# Altium schematic sheet Shematic for Diplom.SchDoc
size 420 x 297 mm; Razrabotal: Гришко; Proveril: {Проверил}; Tkontr: {Т.контр}; Nkontr: {Н. контр.}; Utverdil: {Утвердил}; Oboznachenie: {Обозначение}; Naimenovanie: {Наименование}
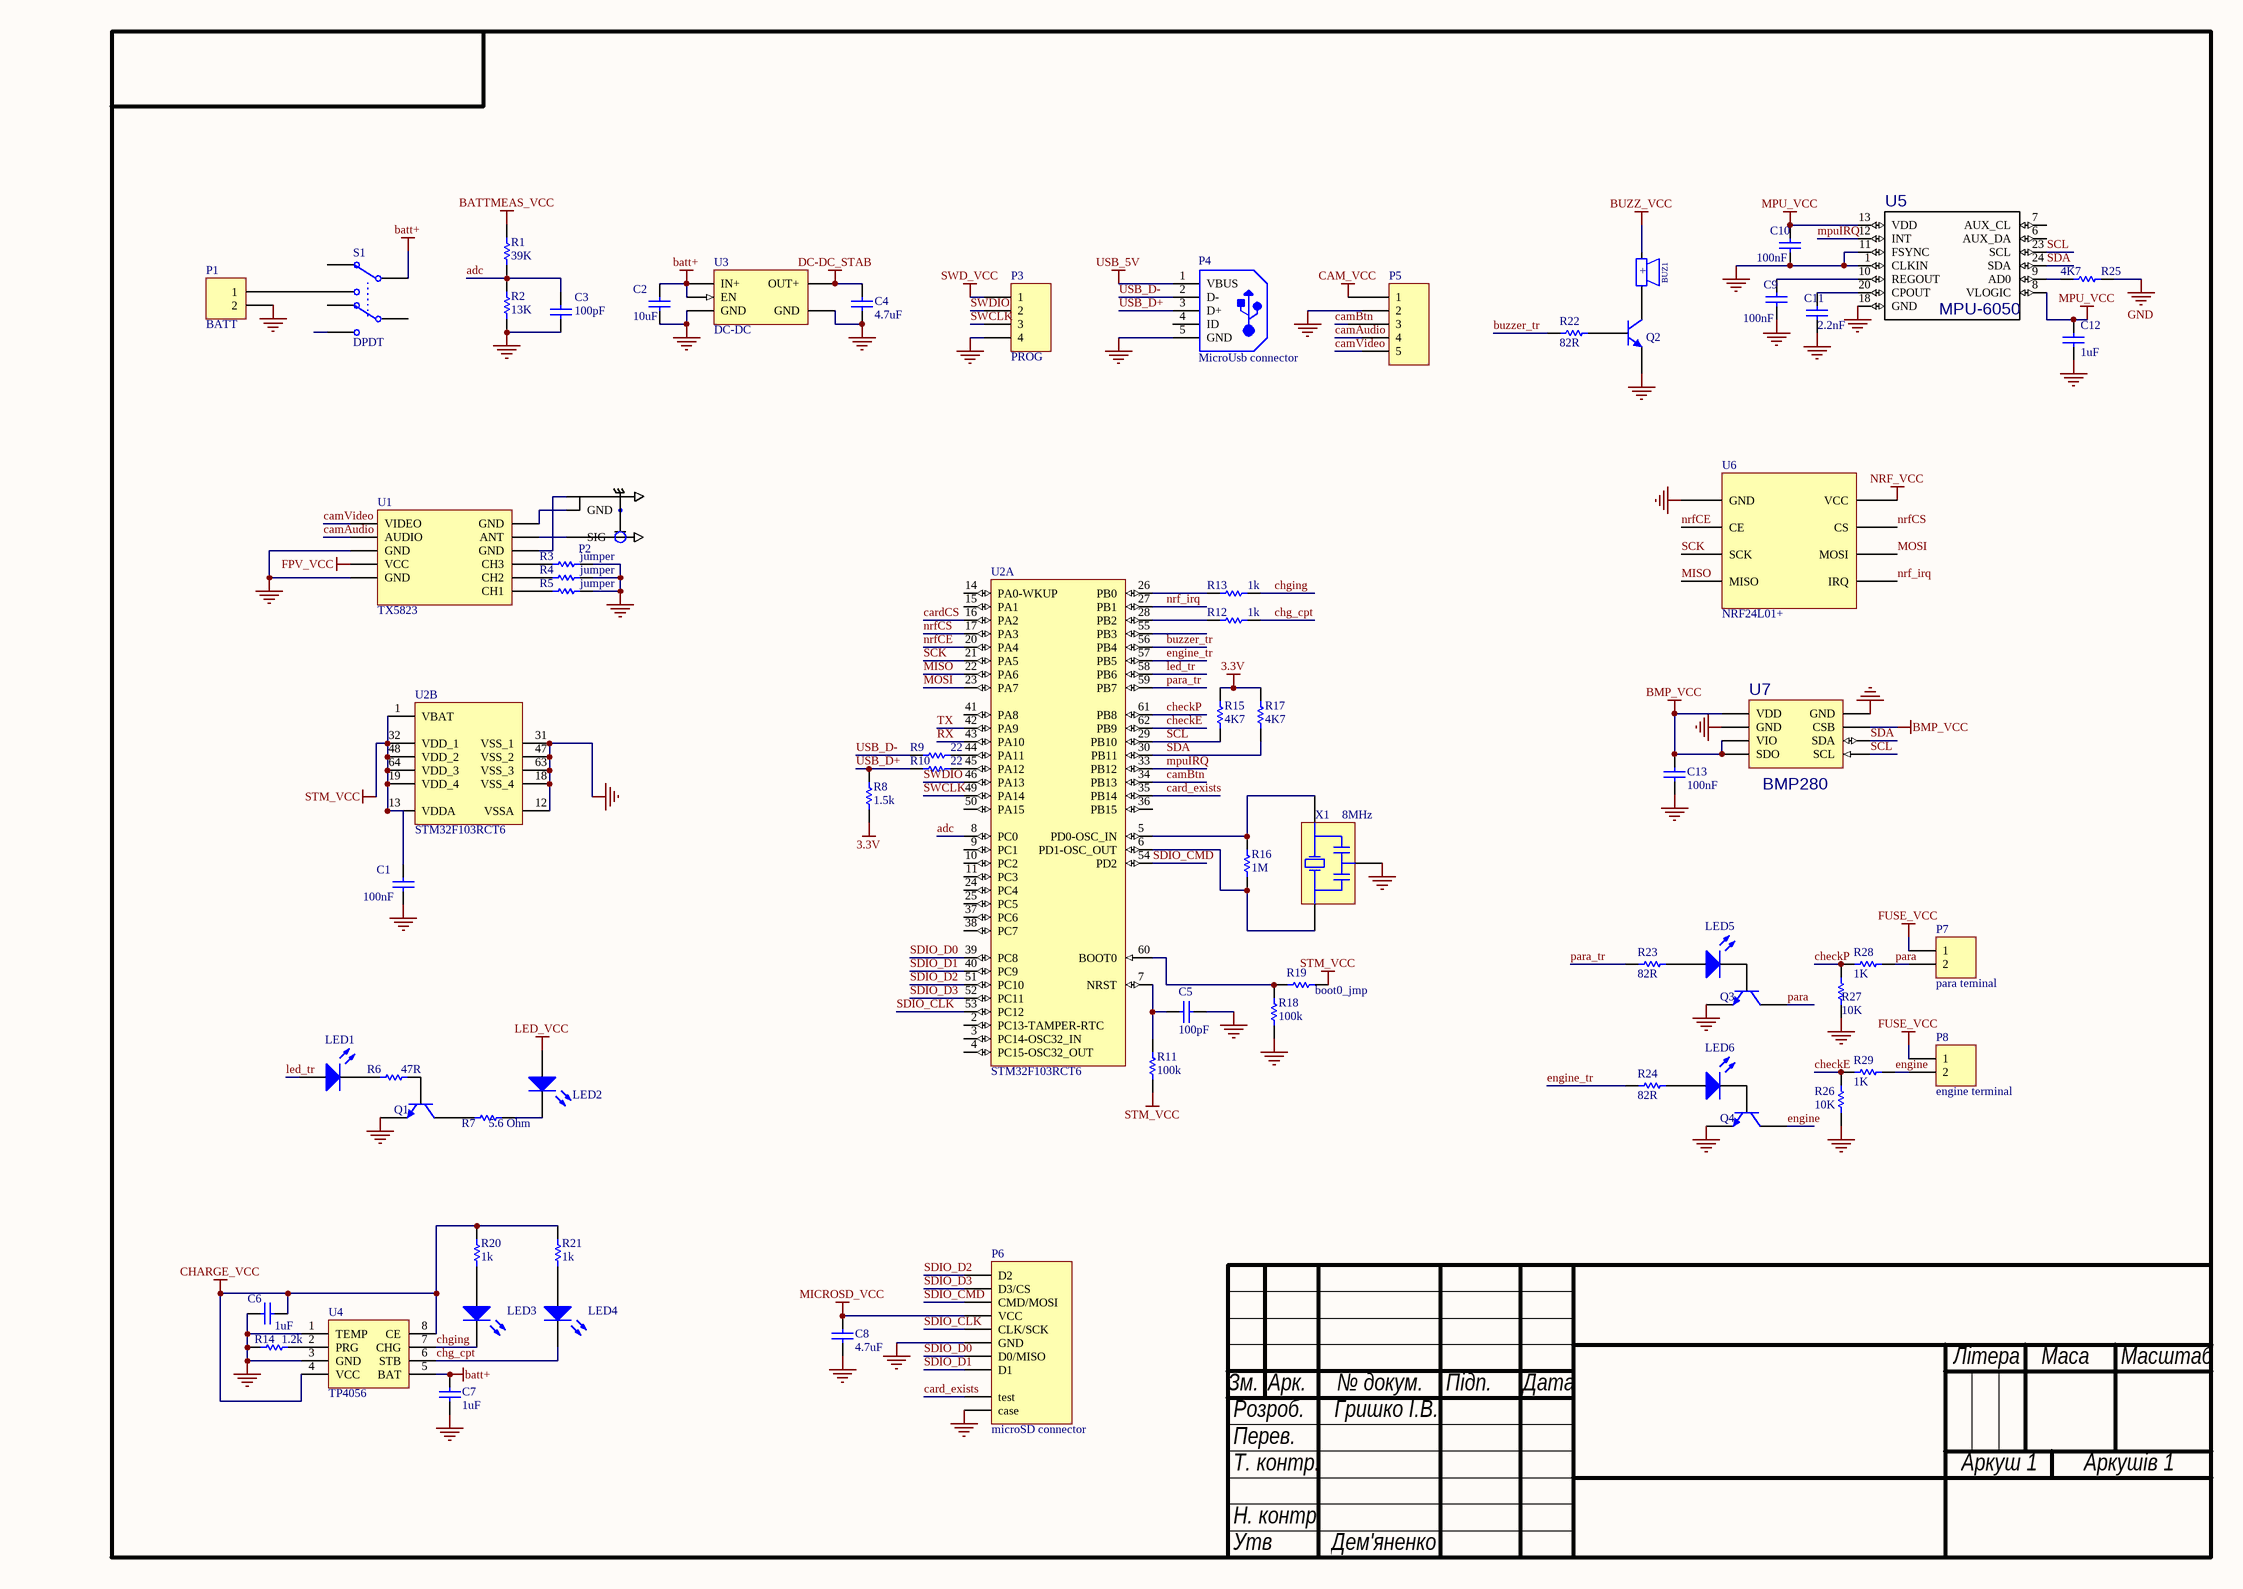
[diagram p0: Shematic for Diplom.SchDoc]

## Parts
(Parts that share a designator on the sheet are numbered #1, #2 ... from top to bottom, then left to right.)
BUZ1  Buzzer  [BUZ12X7,6MM]  (value not drawn)
C1  100nF  [CAPC0603(1608)100_N]
C2  10uF  [CAPC0805(2012)100_L]
C3  100pF  [CAPC0805(2012)100_L]
C4  4.7uF  [CAPC0603(1608)100_N]
C5  100pF  [CAPC0805(2012)100_L]
C6  1uF  [CAP 0805 (2012) L]
C7  1uF  [CAP 0805 (2012) L]
C8  4.7uF  [CAPC0603(1608)100_N]
C9  100nF  [CAPC0603(1608)100_N]
C10  100nF  [CAPC0603(1608)100_N]
C11  2.2nF  [CAPC0603(1608)100_L]
C12  1uF  [CAPC0603(1608)100_L]
C13  100nF  [CAPC0603(1608)100_N]
LED1  0805 LED  [0805 LED]  (value not drawn)
LED2  3W LED  [3W LED red]  (value not drawn)
LED3  0805 LED  [0805 LED]  (value not drawn)
LED4  0805 LED  [0805 LED]  (value not drawn)
LED5  0805 LED  [0805 LED]  (value not drawn)
LED6  0805 LED  [0805 LED]  (value not drawn)
P1  BATT  [XH-2]
P2  IPX  [IPX]  (value not drawn)
P3  PROG  [PLS-4]
P4  MicroUsb connector  [MicroUsb connector]
P5  XH2.54-5  [XH2.54-5]  (value not drawn)
P6  microSD connector  [Micro SD holder + card]
P7  para teminal  [screw-con-2]
P8  engine terminal  [screw-con-2]
Q1  MMBT2222A  [INF-SOT23_M]  (value not drawn)
Q2  MMBT2222A  [INF-SOT23_M]  (value not drawn)
Q3  MMBT2222A  [INF-SOT23_L]  (value not drawn)
Q4  MMBT2222A  [INF-SOT23_N]  (value not drawn)
R1  39K  [6-0805_L]
R2  13K  [RESC0805(2012)_L]
R3  jumper  [RES 0603 (1608) L]
R4  jumper  [RES 0603 (1608) L]
R5  jumper  [RES 0603 (1608) L]
R6  47R  [RESC0805(2012)_N]
R7  5.6 Ohm  [RESC0805(2012)_M]
R8  1.5k  [RESC0603(1608)_N]
R9  22  [RESC0603(1608)_N]
R10  22  [RESC0603(1608)_N]
R11  100k  [RES 0603 (1608) L]
R12  1k  [RESC0805(2012)_N]
R13  1k  [RESC0805(2012)_N]
R14  1.2k  [RES 0805 (2012) L]
R15  4K7  [RESC0603(1608)_N]
R16  1M  [RES 0603 (1608) L]
R17  4K7  [RESC0603(1608)_N]
R18  100k  [RES 0603 (1608) L]
R19  boot0_jmp  [RES 0603 (1608) L]
R20  1k  [RESC0805(2012)_N]
R21  1k  [RESC0805(2012)_N]
R22  82R  [RESC0805(2012)_L]
R23  82R  [RESC0805(2012)_L]
R24  82R  [RESC0805(2012)_L]
R25  4K7  [RESC0603(1608)_N]
R26  10K  [RESC0805(2012)_L]
R27  10K  [RESC0805(2012)_L]
R28  1K  [RESC0805(2012)_L]
R29  1K  [RESC0805(2012)_L]
S1  DPDT  [DPDT  5.8mm SMD]
U1  TX5823  [TX5823]
U2#1  STM32F103RCT6  [STM-LQFP64_N]  (part A of 2)
U2#2  STM32F103RCT6  [STM-LQFP64_N]  (part B of 2)
U3  DC-DC  [DC-DC step up down S9]
U4  TP4056  [SOP-8 N pad]
U5  MPU-6050  [QFN-24-4MM2]
U6  NRF24L01+  [NRF24l01 ant]
U7  BMP280  [LGA-8 BMP280]
X1  8MHz  [MURA-CSTCE_G_A-3_V]

## Nets
3.3V: R8.2 R15.2 R17.2
batt+: C2.2 C7.2 S1.2 U3.4(IN+) U3.5(EN) U4.5(BAT)
BATTMEAS_VCC: R1.2
BMP_VCC: C13.2 U7.2(CSB) U7.5(SDO) U7.6(VIO) U7.8(VDD)
BUZZ_VCC: BUZ1.2
CAM_VCC: P5.1
CHARGE_VCC: C6.2 R20.2 R21.2 U4.4(VCC) U4.8(CE)
DC-DC_STAB: C4.2 U3.2(OUT+)
FPV_VCC: U1.4(VCC)
FUSE_VCC: P7.1 P8.1
GND: C1.1 C2.1 C3.1 C4.1 C5.1 C6.1 C7.1 C8.1 C9.1 C10.2 C11.1 C12.1 C13.1 P1.2 P3.4 P4.5(GND) P4.6(SHLD1) P4.7(SHLD2) P4.8(SHLD3) P4.9(SHLD4) P4.10(SHLD5) P4.11(SHLD6) P5.2 P6.0(case) P6.6(GND) Q1.2(E) Q2.2(E) Q3.2(E) Q4.2(E) R2.2 R3.2 R4.2 R5.2 R14.1 R18.1 R25.2 R26.1 R27.1 U1.3(GND) U1.5(GND) U2#2.12(VSSA) U2#2.18(VSS_4) U2#2.31(VSS_1) U2#2.47(VSS_2) U2#2.63(VSS_3) U3.1(GND) U3.3(GND) U4.1(TEMP) U4.3(GND) U4.PAD U5.1(CLKIN) U5.11(FSYNC) U5.18(GND) U6.1(GND) U7.1(GND) U7.7(GND) X1.2(GND)
LED_VCC: LED2.A
MICROSD_VCC: C8.2 P6.4(VCC)
MPU_VCC: C10.1 C12.2 U5.8(VLOGIC) U5.13(VDD)
NRF_VCC: U6.2(VCC)
STM_VCC: C1.2 R11.1 R19.1 U2#2.1(VBAT) U2#2.13(VDDA) U2#2.19(VDD_4) U2#2.32(VDD_1) U2#2.48(VDD_2) U2#2.64(VDD_3)
SWD_VCC: P3.1
USB_5V: P4.1(VBUS)
adc: C3.2 R1.1 R2.1 U2#1.8(PC0)
buzzer_tr: R22.1 U2#1.56(PB4)
camAudio: P5.4 U1.2(AUDIO)
camBtn: P5.3 U2#1.34(PB13)
camVideo: P5.5 U1.1(VIDEO)
card_exists: P6.9(test) U2#1.35(PB14)
cardCS: U2#1.16(PA2)
checkE: R26.2 R29.2 U2#1.62(PB9)
checkP: R27.2 R28.2 U2#1.61(PB8)
chg_cpt: LED4.2(K) R12.1 U4.6(STB)
chging: LED3.2(K) R13.1 U4.7(CHG)
engine: P8.2 Q4.3(C) R29.1
engine_tr: R24.1 U2#1.57(PB5)
led_tr: LED1.1(A) U2#1.58(PB6)
MISO: U2#1.22(PA6) U6.7(MISO)
MOSI: U2#1.23(PA7) U6.6(MOSI)
mpuIRQ: U2#1.33(PB12) U5.12(INT)
nrf_irq: U2#1.27(PB1) U6.8(IRQ)
nrfCE: U2#1.20(PA4) U6.3(CE)
nrfCS: U2#1.17(PA3) U6.4(CS)
para: P7.2 Q3.3(C) R28.1
para_tr: R23.1 U2#1.59(PB7)
RX: U2#1.43(PA10)
SCK: U2#1.21(PA5) U6.5(SCK)
SCL: R15.1 U2#1.29(PB10) U5.23(SCL) U7.4(SCL)
SDA: R17.1 U2#1.30(PB11) U5.24(SDA) U7.3(SDA)
SDIO_CLK: P6.5(CLK/SCK) U2#1.53(PC12)
SDIO_CMD: P6.3(CMD/MOSI) U2#1.54(PD2)
SDIO_D0: P6.7(D0/MISO) U2#1.39(PC8)
SDIO_D1: P6.8(D1) U2#1.40(PC9)
SDIO_D2: P6.1(D2) U2#1.51(PC10)
SDIO_D3: P6.2(D3/CS) U2#1.52(PC11)
SWCLK: P3.3 U2#1.49(PA14)
SWDIO: P3.2 U2#1.46(PA13)
TX: U2#1.42(PA9)
USB_D+: P4.3(D+) R8.1 R10.2
USB_D-: P4.2(D-) R9.2
NetBUZ1_1: BUZ1.1 Q2.3(C)
NetC5_2: C5.2 R11.2 U2#1.7(NRST)
NetC9_2: C9.2 U5.10(REGOUT)
NetC11_2: C11.2 U5.20(CPOUT)
NetLED1_2: LED1.2(K) R6.1
NetLED2_K: LED2.K R7.2
NetLED3_1: LED3.1(A) R20.1
NetLED4_1: LED4.1(A) R21.1
NetLED5_1: LED5.1(A) R23.2
NetLED5_2: LED5.2(K) Q3.1(B)
NetLED6_1: LED6.1(A) R24.2
NetLED6_2: LED6.2(K) Q4.1(B)
NetP1_1: P1.1 S1.3
NetP2_1: P2.1(GND) U1.11(GND)
NetP2_2: P2.2(GND) U1.9(GND)
NetP2_3: P2.3(SIG) U1.10(ANT)
NetQ1_1: Q1.1(B) R6.2
NetQ1_3: Q1.3(C) R7.1
NetQ2_1: Q2.1(B) R22.2
NetR3_1: R3.1 U1.8(CH3)
NetR4_1: R4.1 U1.7(CH2)
NetR5_1: R5.1 U1.6(CH1)
NetR9_1: R9.1 U2#1.44(PA11)
NetR10_1: R10.1 U2#1.45(PA12)
NetR12_2: R12.2 U2#1.28(PB2)
NetR13_2: R13.2 U2#1.26(PB0)
NetR14_2: R14.2 U4.2(PRG)
NetR16_1: R16.1 U2#1.6(PD1-OSC_OUT) X1.1(X1)
NetR16_2: R16.2 U2#1.5(PD0-OSC_IN) X1.3(X2)
NetR18_2: R18.2 R19.2 U2#1.60(BOOT0)
NetR25_1: R25.1 U5.9(AD0)

Not connected (* = marked no-connect by the designer): P4 4(ID); S1 1 4 5 6; U2#1 2(PC13-TAMPER-RTC) 3(PC14-OSC32_IN) 4(PC15-OSC32_OUT) 9(PC1) 10(PC2) 11(PC3) 14(PA0-WKUP) 15(PA1) 24(PC4) 25(PC5) 36(PB15) 37(PC6) 38(PC7) 41(PA8) 50(PA15) 55(PB3); U5 6(AUX_DA) 7(AUX_CL)

## Notes on the sheet
- Зм.
- Арк.
- № докум.
- Підп.
- Дата
- Літера
- Маса
- Масштаб
- Розроб.
- Перев.
- Т. контр.
- Гришко І.В.
- Аркуш 1
- Аркушів 1
- Н. контр.
- Утв
- Дем'яненко
- (in symbol Buzzer) +

## Library data of the parts
BUZ1 = Buzzer: Active buzzer 5v
C1 C9 C10 C13 = CMP-1035-02585-1: CAP 100nF 16V ±20% 0603 (1608 Metric) Thickness 1mm SMD; Case-EIA: 0603; Tolerance: Â±20%; Case-Metric: 1608; Technology: SMT; Rated Voltage: 16 V; Value: 100nF; Max Thickness: 1 mm
C2 C3 C5 = CMP-1036-02260-1: CAP 200pF 16V ±10% 0805 (2012 Metric) Thickness 1mm SMD; Case-EIA: 0805; Case-Metric: 2012; Tolerance: Â±10%; Value: 200pF; Technology: SMT; Max Thickness: 1 mm; Rated Voltage: 16 V
C4 C8 = CMP-1035-02789-1: CAP 4.7uF 16V ±20% 0603 (1608 Metric) Thickness 1mm SMD; Case-EIA: 0603; Tolerance: Â±20%; Case-Metric: 1608; Max Thickness: 1 mm; Rated Voltage: 16 V; Technology: SMT; Value: 4.7uF
C6 C7 = Cap Cer 0805 (2012): SMD Capacitor Ceramic; Case-EIA: 0805; Case-Metric: 2012; Technology: SMT; Type: Ceramic; Value: 1uF
C11 = CMP-1035-02030-1: CAP 2.2nF 16V ±20% 0603 (1608 Metric) Thickness 1mm SMD; Case-Metric: 1608; Case-EIA: 0603; Tolerance: Â±20%; Value: 2.2nF; Technology: SMT; Rated Voltage: 16 V; Max Thickness: 1 mm
C12 = CMP-1035-02312-1: CAP 10nF 16V ±20% 0603 (1608 Metric) Thickness 1mm SMD; Case-EIA: 0603; Tolerance: Â±20%; Case-Metric: 1608; Max Thickness: 1 mm; Value: 10nF; Technology: SMT; Rated Voltage: 16 V
LED1 LED3-LED6 = 0805 LED: 0805; Published: 8-Jun-2000; LatestRevisionDate: 08-Jul-2005; LatestRevisionNote: Mech Layer 1 removed.; PackageReference: LED-0; Publisher: Altium Limited; PackageDescription: LED; 2 Leads
LED2 = 3W LED: 3W or 1W led without PCB star
P1 = XH-2: XH 2-pin, 2.4mm pitch; LatestRevisionDate: 17-Jul-2002; LatestRevisionNote: Re-released for DXP Platform.; Publisher: Altium Limited
P3 = PLS-4: Single row pins
P6 = microSD: microSD holder; LatestRevisionDate: 17-Jul-2002; LatestRevisionNote: Re-released for DXP Platform.; Publisher: Altium Limited
P7 P8 = screw-con-2: screw con 2-pin, 5.08mm pitch; LatestRevisionDate: 17-Jul-2002; LatestRevisionNote: Re-released for DXP Platform.; Publisher: Altium Limited
Q1-Q4 = CMP-1178-00009-1: NPN Silicon Switching Transistor, 40 V VCEO, 600 mA IC, SOT23, Reel, Green; Manufacturer: Infineon; VCBO (max): 75 V; IC: 150 mA; ICBO (max): 10 nA; VCE (max): 10 V; VCEO (max): 40 V; VEBO (max): 6 V; IC (max): 600 mA; Green: TRUE; ComponentLink1URL: http://www.infineon.com/; ComponentLink2Description: Datasheet; Mounting Technology: Surface Mount; ComponentLink3URL: http://www.infineon.com/dgdl/SOT23-Package_Overview.pdf?folderId=db3a30431936bc4b0119532290053c66&fileId=db3a30431936bc4b0119533468123c85; PackageDescription: 3-Pin Small Outline Transistor Package, 1.3 x 2.9 mm Body, 0.95 mm Pitch; Packing: Reel; PackageVersion: Apr-08; PartNumber: MMBT2222A; Polarity: NPN; ComponentLink2URL: http://www.infineon.com/dgdl/smbt2222a_mmbt2222a.pdf?folderId=db3a30431441fb5d011445fab851018e&fileId=db3a30431441fb5d011445fbaff0018f; PackageReference: SOT23; VCE: 10 V; ComponentLink1Description: Manufacturer URL; ComponentLink3Description: Package Specification
R1 = CMP-1014-00112-1: 39K 0.25W 5% 1206 (3216 Metric)  SMD; Value: 39000.00 Ohm; Case-Metric: 3216; Case-EIA: 1206; Tolerance: 5 %; Power: 0.25 W; Technology: SMT
R2 = CMP-1013-00101-1: 13K 0.125W 5% 0805 (2012 Metric)  SMD; Case-Metric: 2012; Case-EIA: 0805; Value: 13000.00 Ohm; Power: 0.125 W; Tolerance: 5 %; Technology: SMT
R3-R5 R11 R16 R18 R19 = Res 0603: Case-EIA: 0603; Case-Metric: 1608; Power: 0.1W; Technology: SMT
  R3-R5: Value: jumper
  R11 R18: Value: 100k
  R16: Value: 1M
  R19: Value: boot0_jmp
R6 = CMP-1013-00060-1: 270R 0.125W 5% 0805 (2012 Metric)  SMD; Case-Metric: 2012; Case-EIA: 0805; Value: 47R; Power: 0.125 W; Technology: SMT; Tolerance: 5 %
R7 = CMP-1013-00050-1: 100R 0.125W 5% 0805 (2012 Metric)  SMD; Case-EIA: 0805; Case-Metric: 2012; Tolerance: 5 %; Power: 0.125 W; Technology: SMT; Value: 5.6 Ohm
R8-R10 R15 R17 R25 = CMP-1012-00090-1: 4K7 0.1W 5% 0603 (1608 Metric)  SMD; Case-Metric: 1608; Value: 4700.00 Ohm; Case-EIA: 0603; Tolerance: 5 %; Technology: SMT; Power: 0.1 W
R12 R13 R20 R21 = CMP-1013-00060-1: 270R 0.125W 5% 0805 (2012 Metric)  SMD; Value: 47R; Case-Metric: 2012; Case-EIA: 0805; Power: 0.125 W; Technology: SMT; Tolerance: 5 %
R14 = Res 0805: Case-EIA: 0805; Case-Metric: 2012; Power: 0.125W; Technology: SMT; Value: 1.2k
R22-R24 = CMP-1013-00011-1: 2R4 0.125W 5% 0805 (2012 Metric)  SMD; Case-EIA: 0805; Case-Metric: 2012; Technology: SMT; Power: 0.125 W; Value: 82R; Tolerance: 5 %
R26-R29 = CMP-1013-00098-1: 10K 0.125W 5% 0805 (2012 Metric)  SMD; Case-EIA: 0805; Case-Metric: 2012; Value: 10000.00 Ohm; Power: 0.125 W; Technology: SMT; Tolerance: 5 %
S1 = Double switch: Different footprints; Published: 24-Mar-1999; LatestRevisionDate: 17-Jul-2002; LatestRevisionNote: Re-released for DXP Platform.; PackageReference: DPDT-6; Publisher: Altium Limited; PackageDescription: Switch; 6 Leads
U1 = TX5823: FPV video transmitter 200mW
U2#1 U2#2 = CMP-0237-00009-4: ARM Cortex-M3 32-bit MCU, 256 KB Flash, 48 KB Internal RAM, 51 I/Os, 64-pin LQFP, -40 to 85 degC, Tray; I/Os (High Current): 51; Supply Voltage(Vcc) min (V): 2; Operating Frequency(F) (Processor speed) (MHz): 72; D/A Converter: 2x12-bit (2 Channel); Internal RAM Size (kB): 48; FLASH Size (Prog) (kB): 256; A/D Converter: 3x12-bit (16 Channel); Mounting Technology: Surface Mount; ComponentLink2URL: http://www.st.com/st-web-ui/static/active/en/resource/technical/document/datasheet/CD00191185.pdf; ComponentLink1Description: Manufacturer URL; ComponentLink1URL: http://www.st.com/web/en/home.html; Packing: Tray; ComponentLink3URL: http://www.st.com/st-web-ui/static/active/en/resource/technical/document/datasheet/DM00037051.pdf; ComponentLink2Description: Datasheet; Core: ARM Cortex-M3; DatasheetVersion: Rev. 8; PackageReference: LQFP64; ComponentLink3Description: Package Specification; PackageVersion: Rev. 4, 06/2013; PackageDescription: 64-Pin Low Profile Quad Flat Package, 10 x 10 mm Body, 0.5 mm Pitch; PartNumber: STM32F103RCT6
U3 = DC-DC step up down S9
U4 = TP4056: Li battery charger IC
U6 = NRF24L01+: Wirless module 2.4GHz
X1 = CMP-2100-03620-1: Ceramic Resonator, 8 MHz, +/- 0.5%, -20 to 80 degC, 3-Pin SMD, RoHS, Tape and Reel; Manufacturer: Murata; Capacitance: 33pF; Frequency Stability: 0.2%; Datasheet Version: 42339.0; RoHSCompliant: True; Datasheet URL: http://www.murata.com/~/media/webrenewal/support/library/catalog/products/timingdevice/ceralock/p16e.ashx; Case/Package: Ceramic; Load Capacitance: 33pF; Tolerance: 0.5%; Self Resonant Frequency: 8MHz; Mount: SurfaceMount; Height: 0.031inch; Number of Pins: 3; Package Description: 3-Pin Surface Mount Device, Body 3.2 x 1.3 mm, Pitch 1.2 mm; Package Quantity: 1; Lead Free: LeadFree; Contact Plating: Gold; REACH SVHC: NoSVHC; Length: 0.126inch; Width: 0.051inch; Manufacturer URL: http://www.murata.com/; Packaging: TapeandReel; Termination: SMD/SMT; Frequency Tolerance: 0.5%; Max Operating Temperature: 80degC; Composition: Ceramic; Package Reference: CSTCE_G_A-3; Min Operating Temperature: -20degC; Frequency: 8MHz
U5 = MPU-6050: Value: *
U7 = BMP280: Value: *